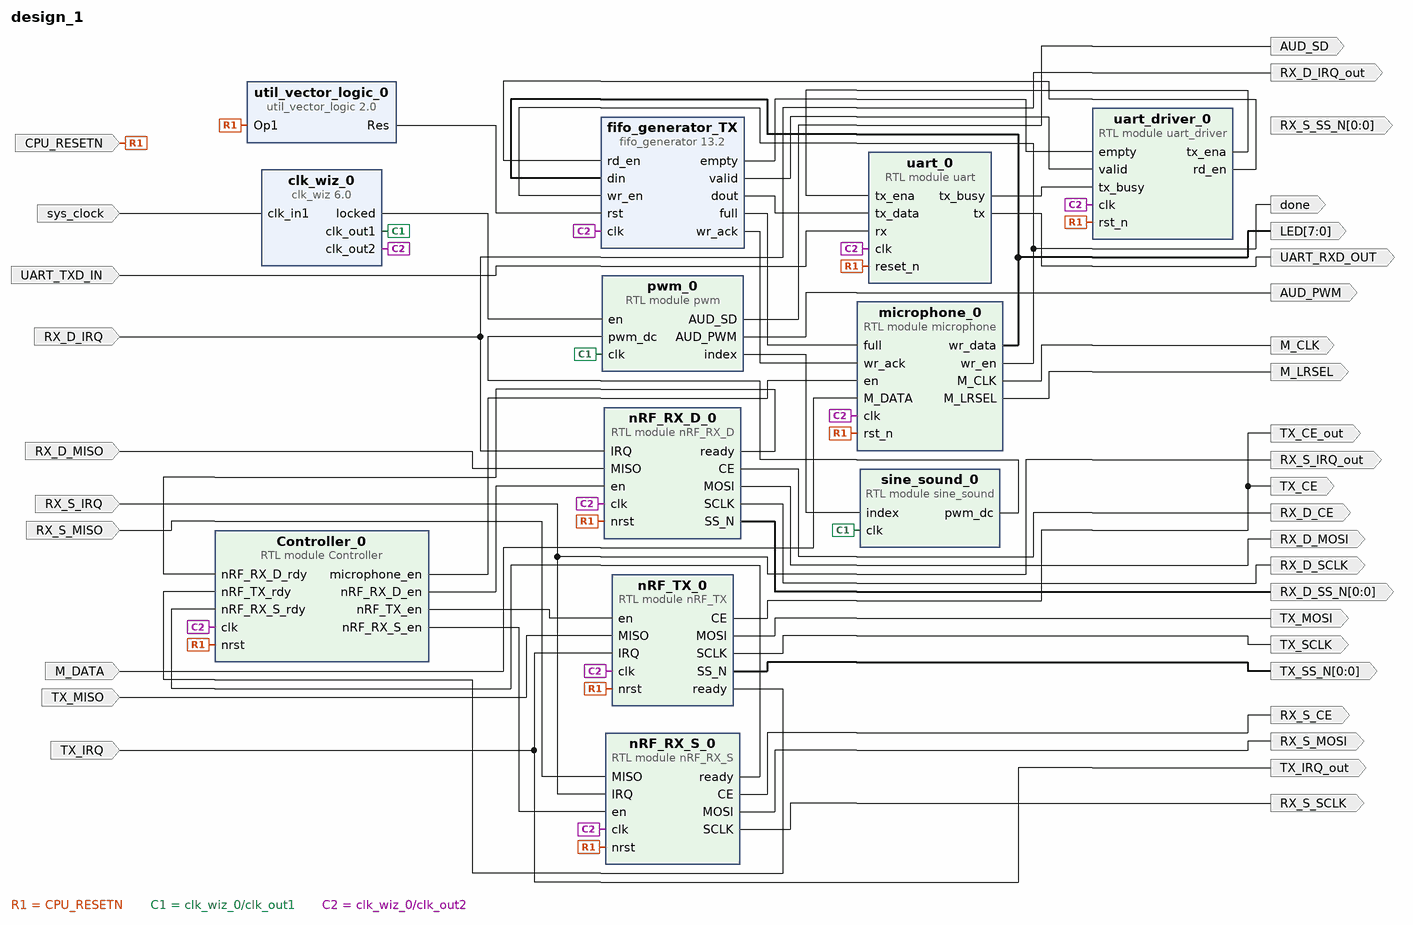
[diagram p0: block diagram of the top level]
# Vivado block design design_1, xc7a100tcsg324-1, Vivado 2020.2
create_bd_design design_1

create_bd_port -dir O TX_CE
create_bd_port -dir I TX_MISO
create_bd_port -dir O TX_MOSI
create_bd_port -dir O TX_SCLK
create_bd_port -dir O -from 0 -to 0 TX_SS_N
create_bd_port -dir I -type intr TX_IRQ
create_bd_port -dir I -type rst CPU_RESETN
create_bd_port -dir O -from 7 -to 0 LED
create_bd_port -dir O RX_S_CE
create_bd_port -dir I -type intr RX_S_IRQ
create_bd_port -dir I RX_S_MISO
create_bd_port -dir O RX_S_MOSI
create_bd_port -dir O RX_S_SCLK
create_bd_port -dir O -from 0 -to 0 RX_S_SS_N
create_bd_port -dir O RX_D_CE
create_bd_port -dir I -type intr RX_D_IRQ
create_bd_port -dir I RX_D_MISO
create_bd_port -dir O RX_D_MOSI
create_bd_port -dir O RX_D_SCLK
create_bd_port -dir O -from 0 -to 0 RX_D_SS_N
create_bd_port -dir O TX_IRQ_out
create_bd_port -dir O RX_S_IRQ_out
create_bd_port -dir O RX_D_IRQ_out
create_bd_port -dir O TX_CE_out
create_bd_port -dir O AUD_SD
create_bd_port -dir O AUD_PWM
create_bd_port -dir I -type clk sys_clock
set_property -dict {CONFIG.FREQ_HZ 100000000 CONFIG.PHASE 0.000} [get_bd_ports sys_clock]
create_bd_port -dir I UART_TXD_IN
create_bd_port -dir O UART_RXD_OUT
create_bd_port -dir O -type clk M_CLK
create_bd_port -dir I M_DATA
create_bd_port -dir O M_LRSEL
create_bd_port -dir O done

create_bd_cell -type module -reference sine_sound sine_sound_0
create_bd_cell -type module -reference pwm pwm_0
create_bd_cell -type ip -vlnv xilinx.com:ip:clk_wiz:6.0 clk_wiz_0
set_property -dict [list \
  CONFIG.CLKOUT1_JITTER 201.426 \
  CONFIG.CLKOUT1_PHASE_ERROR 98.575 \
  CONFIG.CLKOUT1_REQUESTED_OUT_FREQ 12.288 \
  CONFIG.CLKOUT2_JITTER 130.958 \
  CONFIG.CLKOUT2_PHASE_ERROR 98.575 \
  CONFIG.CLKOUT2_USED true \
  CONFIG.CLK_IN1_BOARD_INTERFACE sys_clock \
  CONFIG.MMCM_CLKFBOUT_MULT_F 10.000 \
  CONFIG.MMCM_CLKOUT0_DIVIDE_F 81.375 \
  CONFIG.MMCM_CLKOUT1_DIVIDE 10 \
  CONFIG.MMCM_DIVCLK_DIVIDE 1 \
  CONFIG.NUM_OUT_CLKS 2 \
  CONFIG.USE_BOARD_FLOW true \
  CONFIG.USE_RESET false \
] [get_bd_cells clk_wiz_0]
create_bd_cell -type module -reference nRF_RX_D nRF_RX_D_0
create_bd_cell -type module -reference nRF_TX nRF_TX_0
create_bd_cell -type module -reference uart uart_0
create_bd_cell -type ip -vlnv xilinx.com:ip:fifo_generator:13.2 fifo_generator_TX
set_property -dict [list \
  CONFIG.Fifo_Implementation Common_Clock_Builtin_FIFO \
  CONFIG.Input_Data_Width 8 \
  CONFIG.Input_Depth 512 \
  CONFIG.Valid_Flag true \
  CONFIG.Write_Acknowledge_Flag true \
] [get_bd_cells fifo_generator_TX]
create_bd_cell -type ip -vlnv xilinx.com:ip:util_vector_logic:2.0 util_vector_logic_0
set_property -dict {CONFIG.C_OPERATION not CONFIG.C_SIZE 1} [get_bd_cells util_vector_logic_0]
create_bd_cell -type module -reference uart_driver uart_driver_0
create_bd_cell -type module -reference Controller Controller_0
create_bd_cell -type module -reference microphone microphone_0
create_bd_cell -type module -reference nRF_RX_S nRF_RX_S_0

# ---- connections ----

connect_bd_net -net rst_0_1 [get_bd_ports CPU_RESETN] \
  [get_bd_pins nRF_RX_D_0/nrst] [get_bd_pins nRF_TX_0/nrst] [get_bd_pins uart_0/reset_n] \
  [get_bd_pins util_vector_logic_0/Op1] [get_bd_pins uart_driver_0/rst_n] [get_bd_pins Controller_0/nrst] \
  [get_bd_pins microphone_0/rst_n] [get_bd_pins nRF_RX_S_0/nrst]
connect_bd_net -net SPI_Driver_0_ready [get_bd_pins nRF_TX_0/ready] [get_bd_pins Controller_0/nRF_TX_rdy]
connect_bd_net [get_bd_pins nRF_TX_0/CE] [get_bd_ports TX_CE] [get_bd_ports TX_CE_out]
connect_bd_net [get_bd_pins nRF_TX_0/MOSI] [get_bd_ports TX_MOSI]
connect_bd_net [get_bd_pins nRF_TX_0/SCLK] [get_bd_ports TX_SCLK]
connect_bd_net [get_bd_pins nRF_TX_0/SS_N] [get_bd_ports TX_SS_N]
connect_bd_net -net Controller_0_spi_en [get_bd_pins Controller_0/nRF_TX_en] [get_bd_pins nRF_TX_0/en]
connect_bd_net -net MISO_1 [get_bd_ports TX_MISO] [get_bd_pins nRF_TX_0/MISO]
connect_bd_net -net IRQ_1 [get_bd_ports TX_IRQ] [get_bd_ports TX_IRQ_out] [get_bd_pins nRF_TX_0/IRQ]
connect_bd_net [get_bd_pins Controller_0/nRF_RX_D_en] [get_bd_pins nRF_RX_D_0/en]
connect_bd_net [get_bd_pins Controller_0/nRF_RX_S_en] [get_bd_pins nRF_RX_S_0/en]
connect_bd_net [get_bd_pins nRF_RX_D_0/ready] [get_bd_pins Controller_0/nRF_RX_D_rdy]
connect_bd_net [get_bd_pins nRF_RX_S_0/ready] [get_bd_pins Controller_0/nRF_RX_S_rdy]
connect_bd_net [get_bd_pins nRF_RX_S_0/CE] [get_bd_ports RX_S_CE]
connect_bd_net -net IRQ_0_1 [get_bd_ports RX_S_IRQ] [get_bd_ports RX_S_IRQ_out] [get_bd_pins nRF_RX_S_0/IRQ]
connect_bd_net -net MISO_0_1 [get_bd_ports RX_S_MISO] [get_bd_pins nRF_RX_S_0/MISO]
connect_bd_net [get_bd_pins nRF_RX_S_0/MOSI] [get_bd_ports RX_S_MOSI]
connect_bd_net [get_bd_pins nRF_RX_S_0/SCLK] [get_bd_ports RX_S_SCLK]
# net nRF_RX_S_0_SS_N has one end: RX_S_SS_N
connect_bd_net [get_bd_pins nRF_RX_D_0/CE] [get_bd_ports RX_D_CE]
connect_bd_net -net IRQ_0_2 [get_bd_ports RX_D_IRQ] [get_bd_ports RX_D_IRQ_out] [get_bd_pins nRF_RX_D_0/IRQ]
connect_bd_net -net MISO_0_2 [get_bd_ports RX_D_MISO] [get_bd_pins nRF_RX_D_0/MISO]
connect_bd_net [get_bd_pins nRF_RX_D_0/MOSI] [get_bd_ports RX_D_MOSI]
connect_bd_net [get_bd_pins nRF_RX_D_0/SCLK] [get_bd_ports RX_D_SCLK]
connect_bd_net [get_bd_pins nRF_RX_D_0/SS_N] [get_bd_ports RX_D_SS_N]
connect_bd_net [get_bd_pins clk_wiz_0/clk_out1] [get_bd_pins sine_sound_0/clk] [get_bd_pins pwm_0/clk]
connect_bd_net [get_bd_pins pwm_0/AUD_SD] [get_bd_ports AUD_SD]
connect_bd_net [get_bd_pins pwm_0/AUD_PWM] [get_bd_ports AUD_PWM]
connect_bd_net [get_bd_pins pwm_0/index] [get_bd_pins sine_sound_0/index]
connect_bd_net [get_bd_pins sine_sound_0/pwm_dc] [get_bd_pins pwm_0/pwm_dc]
connect_bd_net -net sys_clock_1 [get_bd_pins clk_wiz_0/clk_out2] \
  [get_bd_pins nRF_RX_D_0/clk] [get_bd_pins nRF_TX_0/clk] [get_bd_pins uart_0/clk] [get_bd_pins fifo_generator_TX/clk] \
  [get_bd_pins uart_driver_0/clk] [get_bd_pins Controller_0/clk] [get_bd_pins microphone_0/clk] [get_bd_pins nRF_RX_S_0/clk]
connect_bd_net [get_bd_ports sys_clock] [get_bd_pins clk_wiz_0/clk_in1]
connect_bd_net [get_bd_ports UART_TXD_IN] [get_bd_pins uart_0/rx]
connect_bd_net [get_bd_pins uart_0/tx] [get_bd_ports UART_RXD_OUT]
connect_bd_net [get_bd_pins uart_driver_0/tx_ena] [get_bd_pins uart_0/tx_ena]
connect_bd_net [get_bd_pins uart_0/tx_busy] [get_bd_pins uart_driver_0/tx_busy]
connect_bd_net [get_bd_pins uart_driver_0/rd_en] [get_bd_pins fifo_generator_TX/rd_en]
connect_bd_net [get_bd_pins fifo_generator_TX/dout] [get_bd_pins uart_0/tx_data]
connect_bd_net [get_bd_pins fifo_generator_TX/empty] [get_bd_pins uart_driver_0/empty]
connect_bd_net [get_bd_pins fifo_generator_TX/valid] [get_bd_pins uart_driver_0/valid]
connect_bd_net [get_bd_pins util_vector_logic_0/Res] [get_bd_pins fifo_generator_TX/rst]
connect_bd_net [get_bd_pins microphone_0/wr_data] [get_bd_pins fifo_generator_TX/din] [get_bd_ports LED]
connect_bd_net [get_bd_pins fifo_generator_TX/full] [get_bd_pins microphone_0/full]
connect_bd_net [get_bd_pins fifo_generator_TX/wr_ack] [get_bd_pins microphone_0/wr_ack]
connect_bd_net [get_bd_pins microphone_0/wr_en] [get_bd_pins fifo_generator_TX/wr_en] [get_bd_ports done]
connect_bd_net [get_bd_pins microphone_0/M_CLK] [get_bd_ports M_CLK]
connect_bd_net -net M_DATA_0_1 [get_bd_ports M_DATA] [get_bd_pins microphone_0/M_DATA]
connect_bd_net [get_bd_pins microphone_0/M_LRSEL] [get_bd_ports M_LRSEL]
connect_bd_net [get_bd_pins Controller_0/microphone_en] [get_bd_pins microphone_0/en]
connect_bd_net [get_bd_pins clk_wiz_0/locked] [get_bd_pins pwm_0/en]

validate_bd_design
save_bd_design
